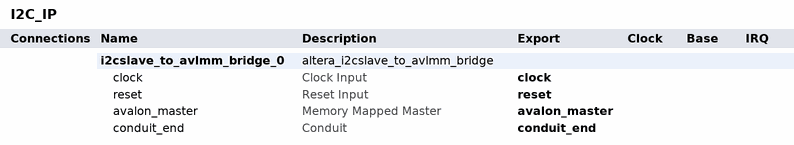
[diagram p0: system contents]
# Platform Designer (Qsys) system I2C_IP, Cyclone 10 LP 10CL025YU256I7G
# Parameters at their usual value, and those the tool derives, are not listed.
package require -exact qsys 21.1
create_system I2C_IP
set_project_property DEVICE_FAMILY {Cyclone 10 LP}
set_project_property DEVICE 10CL025YU256I7G

add_instance i2cslave_to_avlmm_bridge_0 altera_i2cslave_to_avlmm_bridge 21.1
set_instance_property i2cslave_to_avlmm_bridge_0 AUTO_EXPORT true
set_instance_parameter_value i2cslave_to_avlmm_bridge_0 ADDRESS_STEALING 0
set_instance_parameter_value i2cslave_to_avlmm_bridge_0 BYTE_ADDRESSING 2
set_instance_parameter_value i2cslave_to_avlmm_bridge_0 I2C_SLAVE_ADDRESS 85
set_instance_parameter_value i2cslave_to_avlmm_bridge_0 READ_ONLY 0

# exported interfaces
add_interface avalon_master avalon master
set_interface_property avalon_master EXPORT_OF i2cslave_to_avlmm_bridge_0.avalon_master
add_interface clock clock sink
set_interface_property clock EXPORT_OF i2cslave_to_avlmm_bridge_0.clock
add_interface conduit_end conduit end
set_interface_property conduit_end EXPORT_OF i2cslave_to_avlmm_bridge_0.conduit_end
add_interface reset reset sink
set_interface_property reset EXPORT_OF i2cslave_to_avlmm_bridge_0.reset

set_interconnect_requirement {$system} qsys_mm.clockCrossingAdapter HANDSHAKE
set_interconnect_requirement {$system} qsys_mm.enableEccProtection FALSE
set_interconnect_requirement {$system} qsys_mm.insertDefaultSlave FALSE
set_interconnect_requirement {$system} qsys_mm.maxAdditionalLatency 1

save_system I2C_IP.qsys
